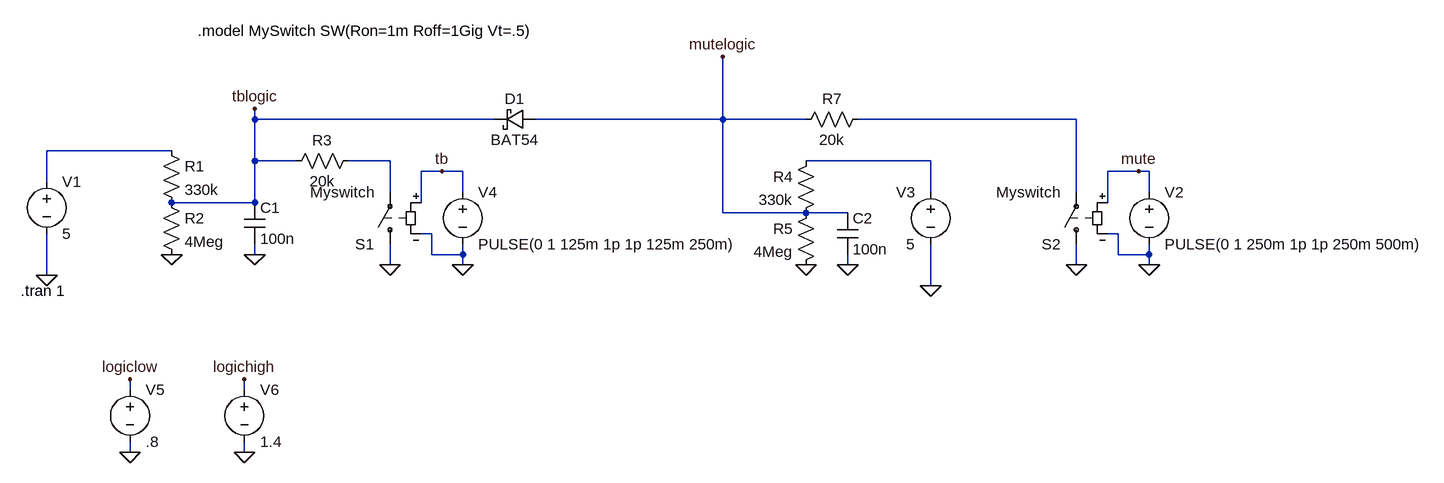
[diagram p0: schematic Buttons.asc]
Buttons.asc, the LTspice schematic file:
Version 4
SHEET 1 2224 680
WIRE 400 -16 400 -32
WIRE 768 -16 400 -16
WIRE 1120 -16 1120 -112
WIRE 1120 -16 832 -16
WIRE 1248 -16 1120 -16
WIRE 1664 -16 1328 -16
WIRE 272 32 80 32
WIRE 400 48 400 -16
WIRE 464 48 400 48
WIRE 608 48 544 48
WIRE 1440 48 1248 48
WIRE 688 64 656 64
WIRE 720 64 688 64
WIRE 1760 64 1712 64
WIRE 1776 64 1760 64
WIRE 80 80 80 32
WIRE 608 96 608 48
WIRE 720 96 720 64
WIRE 1440 96 1440 48
WIRE 1664 96 1664 -16
WIRE 1776 96 1776 64
WIRE 400 112 400 48
WIRE 400 112 272 112
WIRE 656 112 656 64
WIRE 1712 112 1712 64
WIRE 1120 128 1120 -16
WIRE 1248 128 1120 128
WIRE 1312 128 1248 128
WIRE 672 160 656 160
WIRE 1728 160 1712 160
WIRE 400 192 400 176
WIRE 672 192 672 160
WIRE 720 192 720 176
WIRE 720 192 672 192
WIRE 1728 192 1728 160
WIRE 1776 192 1776 176
WIRE 1776 192 1728 192
WIRE 608 208 608 176
WIRE 720 208 720 192
WIRE 1312 208 1312 192
WIRE 1664 208 1664 176
WIRE 1776 208 1776 192
WIRE 80 224 80 160
WIRE 1440 240 1440 176
WIRE 208 400 208 384
WIRE 384 400 384 384
WIRE 208 496 208 480
WIRE 384 496 384 480
FLAG 80 224 0
FLAG 272 192 0
FLAG 720 208 0
FLAG 608 208 0
FLAG 400 192 0
FLAG 1440 240 0
FLAG 1248 208 0
FLAG 1312 208 0
FLAG 1776 208 0
FLAG 1664 208 0
FLAG 400 -32 tblogic
FLAG 1120 -112 mutelogic
FLAG 688 64 tb
FLAG 1760 64 mute
FLAG 208 496 0
FLAG 208 384 logiclow
FLAG 384 496 0
FLAG 384 384 logichigh
SYMBOL voltage 80 64 R0
WINDOW 123 0 0 Left 0
WINDOW 39 0 0 Left 0
SYMATTR InstName V1
SYMATTR Value 5
SYMBOL res 256 16 R0
SYMATTR InstName R1
SYMATTR Value 330k
SYMBOL res 256 96 R0
SYMATTR InstName R2
SYMATTR Value 4Meg
SYMBOL cap 384 112 R0
SYMATTR InstName C1
SYMATTR Value 100n
SYMBOL sw 608 192 R180
SYMATTR InstName S1
SYMATTR Value Myswitch
SYMBOL res 560 32 R90
WINDOW 0 0 56 VBottom 2
WINDOW 3 32 56 VTop 2
SYMATTR InstName R3
SYMATTR Value 20k
SYMBOL voltage 1776 80 R0
WINDOW 123 0 0 Left 0
WINDOW 39 0 0 Left 0
SYMATTR InstName V2
SYMATTR Value PULSE(0 1 250m 1p 1p 250m 500m)
SYMBOL voltage 1440 80 M0
WINDOW 123 0 0 Left 0
WINDOW 39 0 0 Left 0
SYMATTR InstName V3
SYMATTR Value 5
SYMBOL res 1264 32 M0
SYMATTR InstName R4
SYMATTR Value 330k
SYMBOL res 1264 112 M0
SYMATTR InstName R5
SYMATTR Value 4Meg
SYMBOL cap 1296 128 R0
SYMATTR InstName C2
SYMATTR Value 100n
SYMBOL sw 1664 192 R180
SYMATTR InstName S2
SYMATTR Value Myswitch
SYMBOL voltage 720 80 R0
WINDOW 123 0 0 Left 0
WINDOW 39 0 0 Left 0
SYMATTR InstName V4
SYMATTR Value PULSE(0 1 125m 1p 1p 125m 250m)
SYMBOL res 1232 0 R270
WINDOW 0 32 56 VTop 2
WINDOW 3 0 56 VBottom 2
SYMATTR InstName R7
SYMATTR Value 20k
SYMBOL schottky 832 -32 R90
WINDOW 0 0 32 VBottom 2
WINDOW 3 32 32 VTop 2
SYMATTR InstName D1
SYMATTR Value BAT54
SYMATTR Description Diode
SYMATTR Type diode
SYMBOL voltage 208 384 R0
WINDOW 123 0 0 Left 0
WINDOW 39 0 0 Left 0
SYMATTR InstName V5
SYMATTR Value .8
SYMBOL voltage 384 384 R0
WINDOW 123 0 0 Left 0
WINDOW 39 0 0 Left 0
SYMATTR InstName V6
SYMATTR Value 1.4
TEXT 312 -152 Left 2 !.model MySwitch SW(Ron=1m Roff=1Gig Vt=.5)
TEXT 40 248 Left 2 !.tran 1

The netlist it stands for:
* Buttons.asc
V1 N002 0 5
R1 N002 tblogic 330k
R2 tblogic 0 4Meg
C1 tblogic 0 100n
S1 0 N003 tb 0 Myswitch
R3 N003 tblogic 20k
V2 mute 0 PULSE(0 1 250m 1p 1p 250m 500m)
V3 N004 0 5
R4 N004 mutelogic 330k
R5 mutelogic 0 4Meg
C2 mutelogic 0 100n
S2 0 N001 mute 0 Myswitch
V4 tb 0 PULSE(0 1 125m 1p 1p 125m 250m)
R7 mutelogic N001 20k
D1 mutelogic tblogic BAT54
V5 logiclow 0 .8
V6 logichigh 0 1.4
.model D D
.lib standard.dio
.model MySwitch SW(Ron=1m Roff=1Gig Vt=.5)
.tran 1
.backanno
.end